# Altium schematic sheet PROG_PLEIADES.SchDoc
size Tabloid; SheetNumber: 3; SheetTotal: 4; Sheet_Name: Insert name in Document Parameters; Size: 11x17
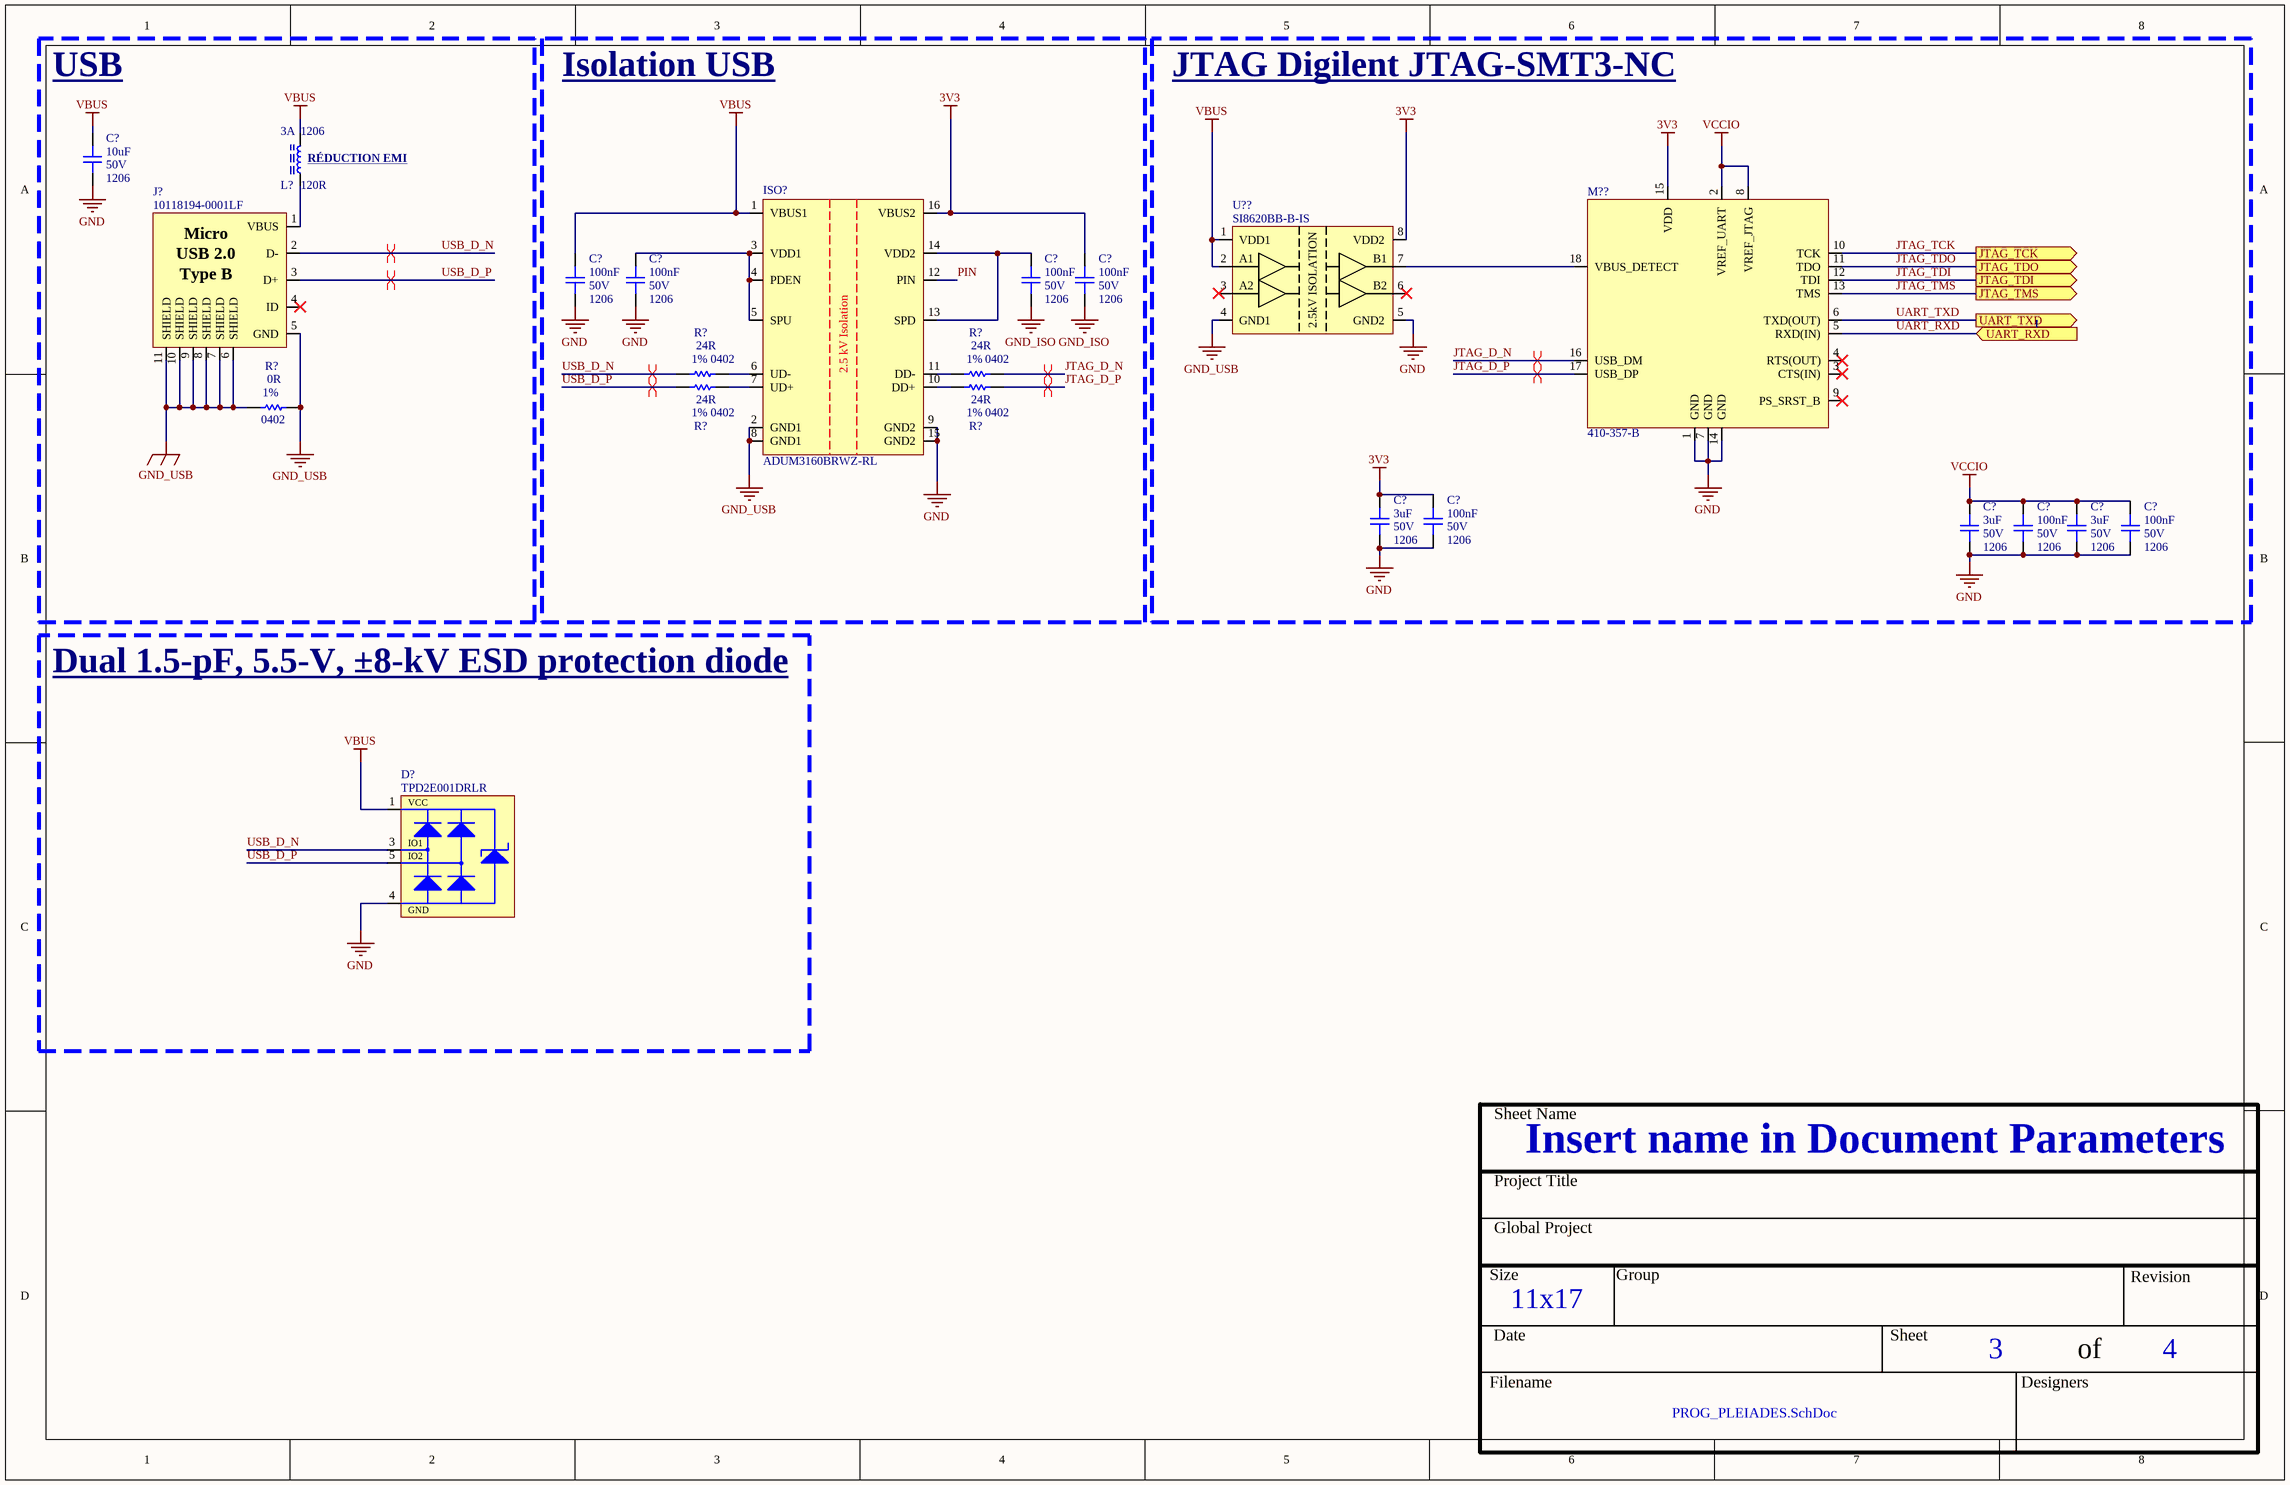
[diagram p0: PROG_PLEIADES.SchDoc]

## Parts
(Parts that share a designator on the sheet are numbered #1, #2 ... from top to bottom, then left to right.)
C?#1  value 10uF  Voltage: 50V  Package: 1206  [CAP_1206]  (hidden comment: CAP - 1206)
C?#2  value 100nF  Voltage: 50V  Package: 1206  [CAP_1206]  (hidden comment: CAP - 1206)
C?#3  value 100nF  Voltage: 50V  Package: 1206  [CAP_1206]  (hidden comment: CAP - 1206)
C?#4  value 100nF  Voltage: 50V  Package: 1206  [CAP_1206]  (hidden comment: CAP - 1206)
C?#5  value 100nF  Voltage: 50V  Package: 1206  [CAP_1206]  (hidden comment: CAP - 1206)
C?#6  value 3uF  Voltage: 50V  Package: 1206  [CAP_1206]  (hidden comment: CAP - 1206)
C?#7  value 100nF  Voltage: 50V  Package: 1206  [CAP_1206]  (hidden comment: CAP - 1206)
C?#8  value 3uF  Voltage: 50V  Package: 1206  [CAP_1206]  (hidden comment: CAP - 1206)
C?#9  value 100nF  Voltage: 50V  Package: 1206  [CAP_1206]  (hidden comment: CAP - 1206)
C?#10  value 3uF  Voltage: 50V  Package: 1206  [CAP_1206]  (hidden comment: CAP - 1206)
C?#11  value 100nF  Voltage: 50V  Package: 1206  [CAP_1206]  (hidden comment: CAP - 1206)
D?  TPD2E001DRLR  [TVS_USB_TPD2E001DRLR]
ISO?  ADUM3160BRWZ-RL  [ISO_ADUM3160BRWZ-RL]
J?  10118194-0001LF  [CON_USB_10118194-0001LF]
L?  value 120R  Current: 3A  Package: 1206  [FER_1206]  (hidden comment: FER - 1206)
M??  410-357-B  [MOD_JTAG_410-357-B]
R?#1  value 24R  Package: 0402  Precision: 1%  [RES_0402]  (hidden comment: RES - 0402)
R?#2  value 24R  Package: 0402  Precision: 1%  [RES_0402]  (hidden comment: RES - 0402)
R?#3  value 24R  Package: 0402  Precision: 1%  [RES_0402]  (hidden comment: RES - 0402)
R?#4  value 24R  Package: 0402  Precision: 1%  [RES_0402]  (hidden comment: RES - 0402)
R?#5  value 0R  Package: 0402  Precision: 1%  [RES_0402]  (hidden comment: RES - 0402)
U??  SI8620BB-B-IS  [ISO_SI8620BB-B-IS]

## Blocks framed on the sheet
USB: C?#1 J? L? R?#5
Isolation USB: C?#2-C?#5 ISO? R?#1-R?#4
JTAG Digilent JTAG-SMT3-NC: C?#6-C?#11 M?? U??
Dual 1.5-pF, 5.5-V, ±8-kV ESD protection diode: D?

## Ports
JTAG_TCK (out), JTAG_TDI (out), JTAG_TDO (out), JTAG_TMS (out), UART_RXD (in), UART_TXD (out)

## Nets
3V3: C?#5.2 C?#6.2 C?#7.2 ISO?.16(VBUS2) M??.15(VDD) U??.8(VDD2)
GND: C?#1.1 C?#2.1 C?#3.1 C?#6.1 C?#7.1 C?#8.1 C?#9.1 C?#10.1 C?#11.1 D?.4(GND) ISO?.9(GND2) ISO?.15(GND2) M??.1(GND) M??.7(GND) M??.14(GND) U??.5(GND2)
GND_ISO: C?#4.1 C?#5.1
GND_USB: ISO?.2(GND1) ISO?.8(GND1) J?.5(GND) J?.6(SHIELD) J?.7(SHIELD) J?.8(SHIELD) J?.9(SHIELD) J?.10(SHIELD) J?.11(SHIELD) R?#5.1 R?#5.2 U??.4(GND1)
VBUS: C?#1.2 C?#2.2 D?.1(VCC) ISO?.1(VBUS1) L?.1 U??.1(VDD1) U??.2(A1)
VCCIO: C?#8.2 C?#9.2 C?#10.2 C?#11.2 M??.2(VREF_UART) M??.8(VREF_JTAG)
JTAG_D_N: M??.16(USB_DM) R?#2.1
JTAG_D_P: M??.17(USB_DP) R?#4.1
JTAG_TCK: M??.10(TCK) ; port JTAG_TCK
JTAG_TDI: M??.12(TDI) ; port JTAG_TDI
JTAG_TDO: M??.11(TDO) ; port JTAG_TDO
JTAG_TMS: M??.13(TMS) ; port JTAG_TMS
PIN: ISO?.12(PIN)
UART_RXD: M??.5(RXD(IN)) ; port UART_RXD
UART_TXD: M??.6(TXD(OUT)) ; port UART_TXD
USB_D_N: D?.3(IO1) J?.2(D-) R?#1.2
USB_D_P: D?.5(IO2) J?.3(D+) R?#3.2
NetC?#3_2: C?#3.2 ISO?.3(VDD1) ISO?.4(PDEN) ISO?.5(SPU)
NetC?#4_2: C?#4.2 ISO?.13(SPD) ISO?.14(VDD2)
NetISO?_6: ISO?.6(UD-) R?#1.1
NetISO?_7: ISO?.7(UD+) R?#3.1
NetISO?_10: ISO?.10(DD+) R?#4.2
NetISO?_11: ISO?.11(DD-) R?#2.2
NetJ?_1: J?.1(VBUS) L?.2
NetM??_18: M??.18(VBUS_DETECT) U??.7(B1)

Not connected (* = marked no-connect by the designer): D? 2(NC); J? 4(ID)*; M?? 3(CTS(IN))* 4(RTS(OUT))* 9(PS_SRST_B)*; U?? 3(A2)* 6(B2)*

## Layout directives
differential pair: JTAG_D_N, JTAG_D_P, USB_D_N, USB_D_P

## Notes on the sheet
- (near L?) RÉDUCTION EMI
- Sheet Name
- Project Title
- Global Project
- Size
- Group
- Revision
- Date
- Sheet
- of
- Filename
- Designers
- (in symbol CON_USB_10118194-0001LF) Micro; USB 2.0; Type B
- (in symbol ISO_ADUM3160BRWZ-RL) 2.5 kV Isolation
- (in symbol ISO_SI8620BB-B-IS) 2.5kV ISOLATION

## Library data of the parts
C?#1-C?#11 = CAP - 1206: Precision: 10%; Current: *; CreatedBy: Jonathan Bouchard; Power: *
D? = TVS_USB_TPD2E001DRLR: TVS - USB TVS DIODE 5.5V - SOT-553; Manufacturer #1: Texas Instruments; Value: 11V Breakdown; Voltage Rating: 5.5V (Max); GRAMS Lib Spec: 2.8; Magnetic Material: YES; Cryo: UNKNOWN; Tolerance: *; Current Rating: *; Power Max: *; HelpURL: http://www.ti.com/lit/ds/symlink/tpd2e001.pdf; CreatedBy/Date: Jonathan Bouchard 2018-07-10; VerifiedBy: Arnaud Samson 16-07-18; Temperature: -40°C ~ 85°C (TA); Package: SOT-553; Manufacturer #2: *; Note: *; Assembly Type: SMD; Part Number #2: *; Part Number #1: TPD2E001DRLR; Polarized: YES; Supplier 1: Digi-Key; Supplier Part Number 1: 296-21883-1-ND
ISO? = ISO_ADUM3160BRWZ-RL: ISO - DGTL ISO 2.5KV 2CH USB - 16SOIC; Manufacturer #1: Analog Devices; Value: 2500Vrms voltage isolation; Voltage Rating: 3~5.5V; GRAMS Lib Spec: 2.8; Magnetic Material: UNKNOWN; Polarized: Yes; Tolerance: *; Current Rating: *; Power Max: *; HelpURL: https://www.analog.com/media/en/technical-documentation/data-sheets/ADuM3160.pdf; CreatedBy/Date: Tommy Rossignol 2018-11-16; VerifiedBy: Caroline Paulin - 13 février 2019; Temperature: -40°C ~ 105°C; Package: 16-SOIC; Manufacturer #2: *; Assembly Type: SMD; Part Number #2: *; Part Number #1: ADUM3160BRWZ-RL; Supplier 1: Digi-Key; Supplier Part Number 1: ADUM3160BRWZ-RLCT-ND; Cryo: UNKNOWN
J? = CON_USB_10118194-0001LF: CON - USB MICRO B RECPT SMT R/A - 4PIN; Manufacturer #1: Amphenol FCI; Value: USB - Micro B; Voltage Rating: 100VAC; Current Rating: 1.8A; GRAMS Lib Spec: 2.8; Magnetic Material: YES; Cryo: UNKNOWN; Tolerance: *; Power Max: *; HelpURL: https://cdn.amphenol-icc.com/media/wysiwyg/files/drawing/10118194.pdf; CreatedBy/Date: Arnaud Samson - 09/07/18; VerifiedBy: Jonathan Bouchard 2018-07-12; Temperature: -30°C ~ 80°C; Package: 5-SMD; Manufacturer #2: *; Note: *; Assembly Type: SMD; Part Number #2: *; Part Number #1: 10118194-0001LF; Polarized: YES; Supplier 1: Digi-Key; Supplier Part Number 1: 609-4618-1-ND
M?? = MOD_JTAG_410-357-B: MOD - JTAG-SMT3-NC Programming Module For Xilinx FPGA - 18-SMT; Manufacturer #1: Digilent; Voltage Rating: VDD: 2.97V~3.63V, VJTAG/VUART: 1.65V~5.5V; GRAMS Lib Spec: 2.8; Note: Prior to reflow, the JTAG-SMT3-NC module must be dried at 125°C for 17 hours; Magnetic Material: Unknown; Polarized: Yes; Value: *; Tolerance: *; Current Rating: *; Power Max: *; HelpURL: https://reference.digilentinc.com/_media/reference/programmers/jtag-smt3/jtag-smt3-nc_rm.pdf; CreatedBy/Date: Tommy Rossignol 2018-11-23; VerifiedBy: Nicolas V. (2019-01-28); Temperature: -40°C ~ 85°C; Package: 18-pad SMT; Manufacturer #2: *; Assembly Type: SMD; Part Number #2: *; Part Number #1: 410-357-B; Supplier 1: Digi-Key; Supplier Part Number 1: 1286-1196-ND; Cryo: UNKNOWN
R?#1-R?#5 = RES - 0402: Voltage: 50V; Power: 1/16W; Current: *; CreatedBy: Jonathan Bouchard
U?? = ISO_SI8620BB-B-IS: ISO - Dual-Channel Digital Isolator (default Low) - 8-SOIC; Manufacturer #1: Silicon Labs; Voltage Rating: 2.5-5.5V; GRAMS Lib Spec: 2.8; Magnetic Material: Unknown; Polarized: Yes; Value: *; Tolerance: *; Current Rating: *; Power Max: *; HelpURL: https://www.silabs.com/documents/public/data-sheets/si861x-2x-datasheet.pdf; CreatedBy/Date: Joel Lemay 2018-06-05; VerifiedBy: Caroline Paulin - 12 sept 2018; Temperature: -40°C ~ 125°C; Package: 8-SOIC; Manufacturer #2: *; Assembly Type: SMD; Part Number #2: *; Part Number #1: SI8620BB-B-IS; Supplier 1: Digi-Key; Supplier Part Number 1: 336-2567-ND; Cryo: UNKNOWN
L? = FER - 1206: Voltage: *; CreatedBy: Jonathan Bouchard; Power: *; Precision: *